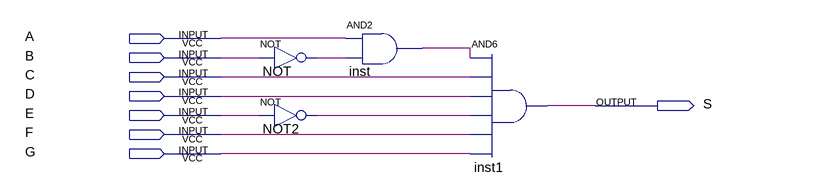
[diagram p0: schematic sheet]
// Quartus schematic Block2.bdf as structural Verilog: 4 symbols, 8 pins
module Block2 (
  input  A,
  input  B,
  input  C,
  input  D,
  input  E,
  input  F,
  input  G,
  output S
);

  wire inst_out, NOT2_out, NOT_out;

  not NOT (NOT_out, B);
  not NOT2 (NOT2_out, E);
  and inst (inst_out, A, NOT_out);
  and inst1 (S, inst_out, C, D, NOT2_out, F, G);
endmodule
